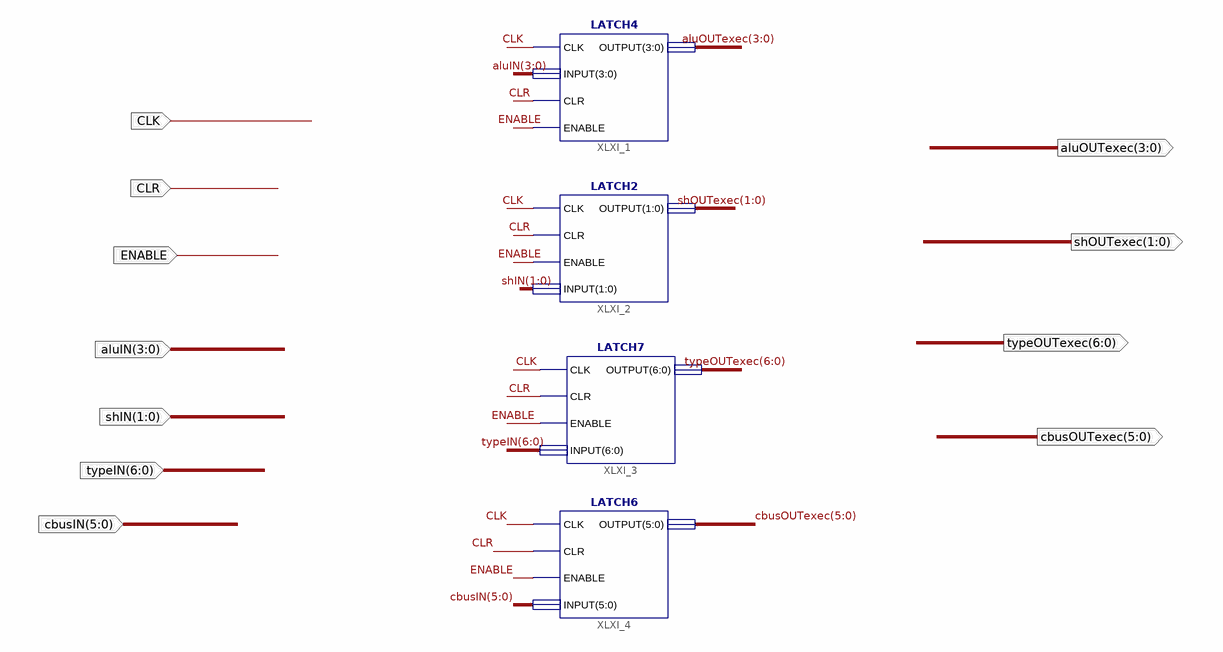
[diagram p0: schematic sheet 1]
// Xilinx ISE schematic toExecute.sch (artix7) as structural Verilog: 4 symbols, 11 ports
module toExecute (
  input  CLK,
  input  CLR,
  input  ENABLE,
  input  [3:0] aluIN,
  input  [1:0] shIN,
  input  [6:0] typeIN,
  input  [5:0] cbusIN,
  output [3:0] aluOUTexec,
  output [1:0] shOUTexec,
  output [6:0] typeOUTexec,
  output [5:0] cbusOUTexec
);

  LATCH4 XLXI_1 (.CLK(CLK), .INPUT(aluIN), .CLR(CLR), .ENABLE(ENABLE), .OUTPUT(aluOUTexec));
  LATCH2 XLXI_2 (.CLK(CLK), .CLR(CLR), .ENABLE(ENABLE), .INPUT(shIN), .OUTPUT(shOUTexec));
  LATCH7 XLXI_3 (.CLK(CLK), .CLR(CLR), .ENABLE(ENABLE), .INPUT(typeIN), .OUTPUT(typeOUTexec));
  LATCH6 XLXI_4 (.CLK(CLK), .CLR(CLR), .ENABLE(ENABLE), .INPUT(cbusIN), .OUTPUT(cbusOUTexec));
endmodule
